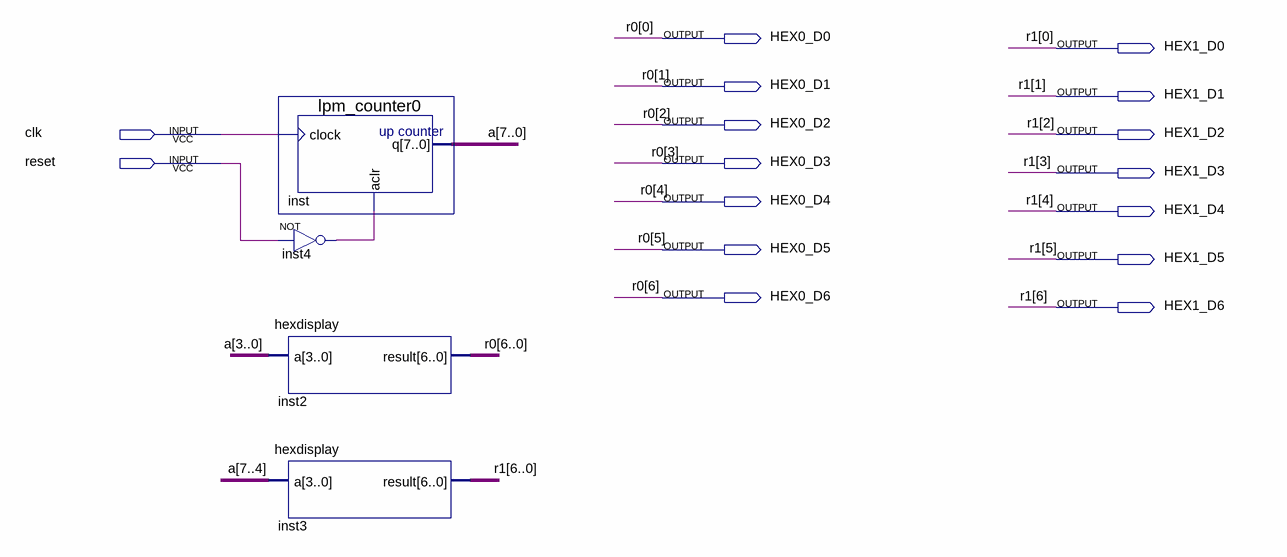
[diagram p0: schematic sheet]
// Quartus schematic task1.bdf as structural Verilog: 4 symbols, 16 pins
module task1 (
  input  clk,
  input  reset,
  output HEX0_D0,
  output HEX1_D0,
  output HEX0_D1,
  output HEX1_D1,
  output HEX0_D2,
  output HEX1_D2,
  output HEX0_D3,
  output HEX1_D3,
  output HEX0_D4,
  output HEX1_D4,
  output HEX0_D5,
  output HEX1_D5,
  output HEX0_D6,
  output HEX1_D6
);

  wire inst4_out;
  wire [7:0] a;

  lpm_counter0 inst (.clock(clk), .aclr(inst4_out), .q(a));
  not inst4 (inst4_out, reset);
  hexdisplay inst2 (.a(a[3:0]), .result({HEX0_D6, HEX0_D5, HEX0_D4, HEX0_D3, HEX0_D2, HEX0_D1, HEX0_D0}));
  hexdisplay inst3 (.a(a[7:4]), .result({HEX1_D6, HEX1_D5, HEX1_D4, HEX1_D3, HEX1_D2, HEX1_D1, HEX1_D0}));

  // Other names for the same wires on the sheet: r0[6:0] = {HEX0_D6, HEX0_D5, HEX0_D4, HEX0_D3, HEX0_D2, HEX0_D1, HEX0_D0};
  //   r1[6:0] = {HEX1_D6, HEX1_D5, HEX1_D4, HEX1_D3, HEX1_D2, HEX1_D1, HEX1_D0}
endmodule
